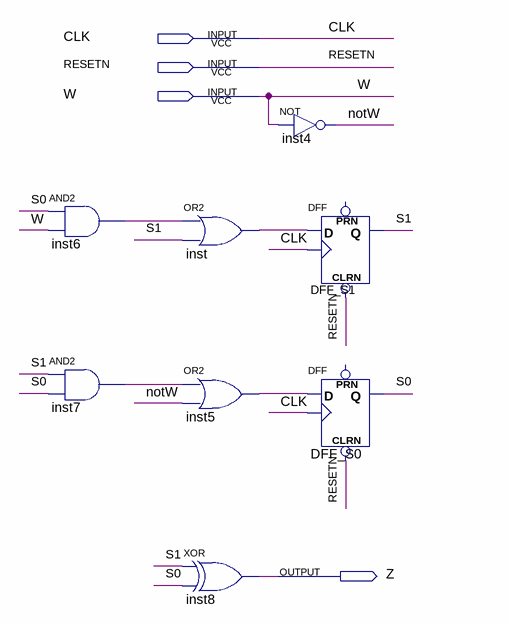
[diagram p0: schematic sheet]
// Quartus schematic Q2c.bdf as structural Verilog: 8 symbols, 4 pins
module Q2c (
  input  CLK,
  input  RESETN,
  input  W,
  output Z
);

  wire inst5_out, inst6_out, inst7_out, inst_out, notW, S0, S1;

  and inst6 (inst6_out, S0, W);
  and inst7 (inst7_out, S1, S0);
  or inst (inst_out, inst6_out, S1);
  or inst5 (inst5_out, inst7_out, notW);
  xor inst8 (Z, S1, S0);
  not inst4 (notW, W);
  DFF DFF_S1 (.CLRN(RESETN), .CLK(CLK), .D(inst_out), .Q(S1));  // open: PRN
  DFF DFF_S0 (.CLRN(RESETN), .CLK(CLK), .D(inst5_out), .Q(S0));  // open: PRN
endmodule
